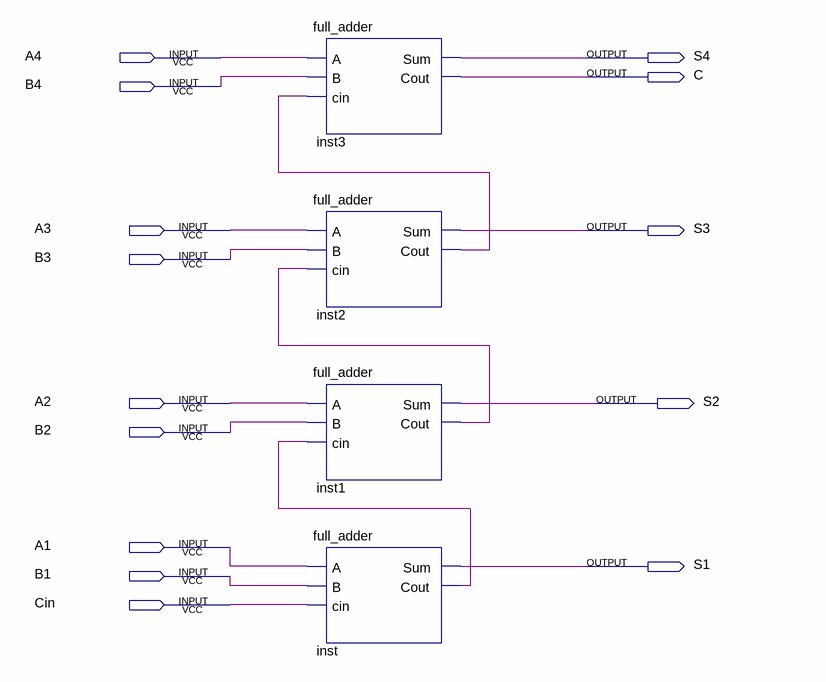
[diagram p0: schematic sheet]
// Quartus schematic full_adder_4b.bdf as structural Verilog: 4 symbols, 14 pins
module full_adder_4b (
  input  A4,
  input  B4,
  input  A3,
  input  B3,
  input  A2,
  input  B2,
  input  A1,
  input  B1,
  input  Cin,
  output S4,
  output C,
  output S3,
  output S2,
  output S1
);

  wire inst1_cout, inst2_cout, inst_cout;

  full_adder inst3 (.A(A4), .B(B4), .cin(inst2_cout), .Sum(S4), .Cout(C));
  full_adder inst2 (.A(A3), .B(B3), .cin(inst1_cout), .Sum(S3), .Cout(inst2_cout));
  full_adder inst1 (.A(A2), .B(B2), .cin(inst_cout), .Sum(S2), .Cout(inst1_cout));
  full_adder inst (.A(A1), .B(B1), .cin(Cin), .Sum(S1), .Cout(inst_cout));
endmodule
